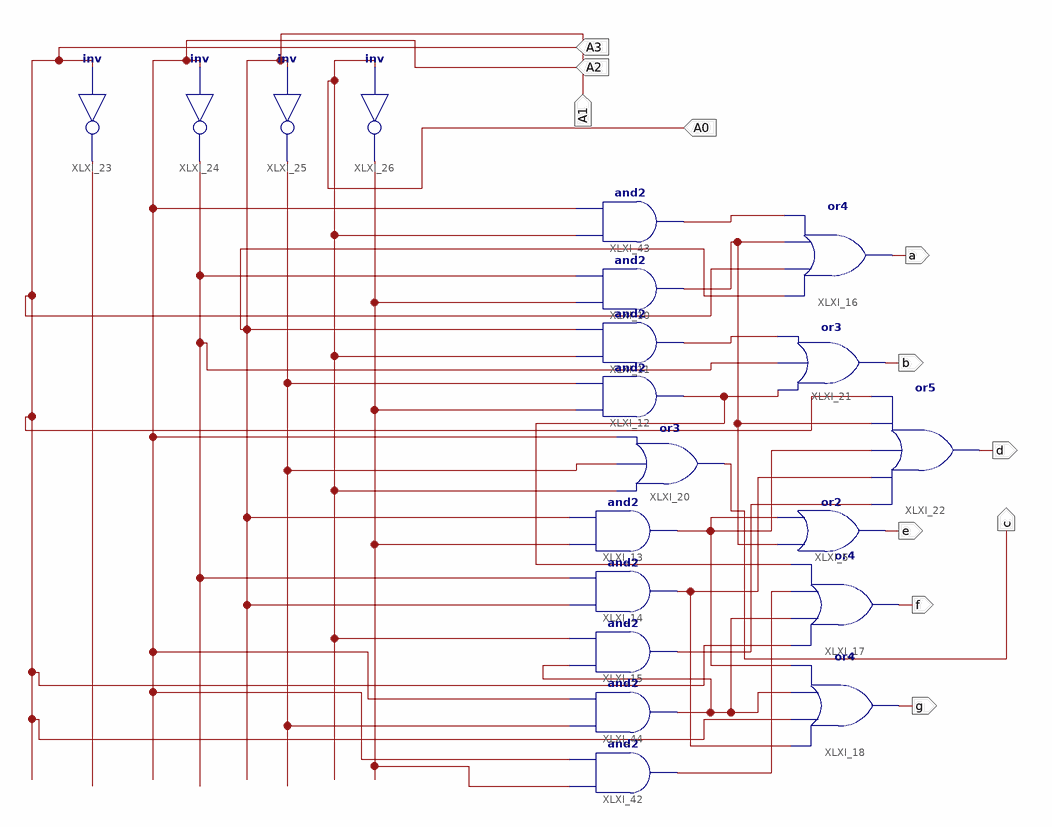
[diagram p0: schematic sheet 1]
// Xilinx ISE schematic seven_segment_circuit.sch (spartan6) as structural Verilog: 20 symbols, 11 ports
module seven_segment_circuit (
  input  A2,
  input  A1,
  input  A0,
  input  A3,
  output a,
  output b,
  output c,
  output d,
  output e,
  output f,
  output g
);

  wire XLXN_4, XLXN_10, XLXN_11, XLXN_13, XLXN_14, XLXN_16, XLXN_21, XLXN_24, XLXN_25, XLXN_27, XLXN_28,
       XLXN_29, XLXN_31;

  not XLXI_23 (XLXN_10, A3);
  not XLXI_24 (XLXN_11, A2);
  not XLXI_25 (XLXN_29, A1);
  not XLXI_26 (XLXN_13, A0);
  and XLXI_10 (XLXN_14, XLXN_13, XLXN_11);
  and XLXI_11 (XLXN_16, A0, A1);
  and XLXI_12 (XLXN_31, XLXN_13, XLXN_29);
  and XLXI_13 (XLXN_21, XLXN_13, A1);
  and XLXI_14 (XLXN_24, A1, XLXN_11);
  and XLXI_15 (XLXN_25, XLXN_28, A0);
  or XLXI_16 (a, A1, A3, XLXN_14, XLXN_4);
  or XLXI_17 (f, A3, XLXN_28, XLXN_27, XLXN_31);
  or XLXI_18 (g, XLXN_24, A3, XLXN_28, XLXN_21);
  or XLXI_20 (c, A0, XLXN_29, A2);
  or XLXI_21 (b, XLXN_31, XLXN_11, XLXN_16);
  or XLXI_5 (e, XLXN_14, XLXN_21);
  or XLXI_22 (d, XLXN_25, XLXN_24, XLXN_21, XLXN_14, A3);
  and XLXI_42 (XLXN_27, XLXN_13, A2);
  and XLXI_43 (XLXN_4, A0, A2);
  and XLXI_44 (XLXN_28, XLXN_29, A2);

  // Notes on the sheet:
  //   LOC on signal A2 = P56
  //   LOC on signal A1 = P57
  //   LOC on signal A0 = P58
  //   LOC on signal a = P41
  //   LOC on signal b = P40
  //   LOC on signal c = P35
  //   LOC on signal d = P34
  //   LOC on signal e = P32
  //   LOC on signal f = P29
  //   LOC on signal g = P27
  //   LOC on signal A3 = P55
endmodule
